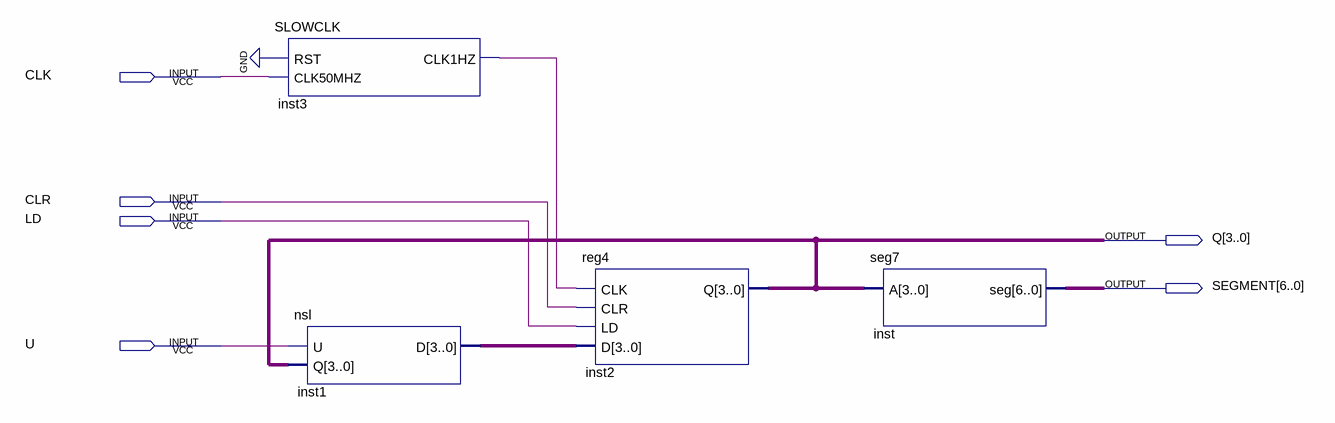
[diagram p0: schematic sheet]
// Quartus schematic counter.bdf as structural Verilog: 4 symbols, 6 pins
module counter (
  input  CLK,
  input  CLR,
  input  LD,
  input  U,
  output [3:0] Q,
  output [6:0] SEGMENT
);

  wire inst3_clk1hz;
  wire [3:0] inst1_d;

  SLOWCLK inst3 (.RST(1'b0), .CLK50MHZ(CLK), .CLK1HZ(inst3_clk1hz));
  nsl inst1 (.U(U), .Q(Q), .D(inst1_d));
  reg4 inst2 (.CLK(inst3_clk1hz), .CLR(CLR), .LD(LD), .D(inst1_d), .Q(Q));
  seg7 inst (.A(Q), .seg(SEGMENT));
endmodule
